# EAGLE schematic chunkycopter-v2 (EAGLE 9.6.2)
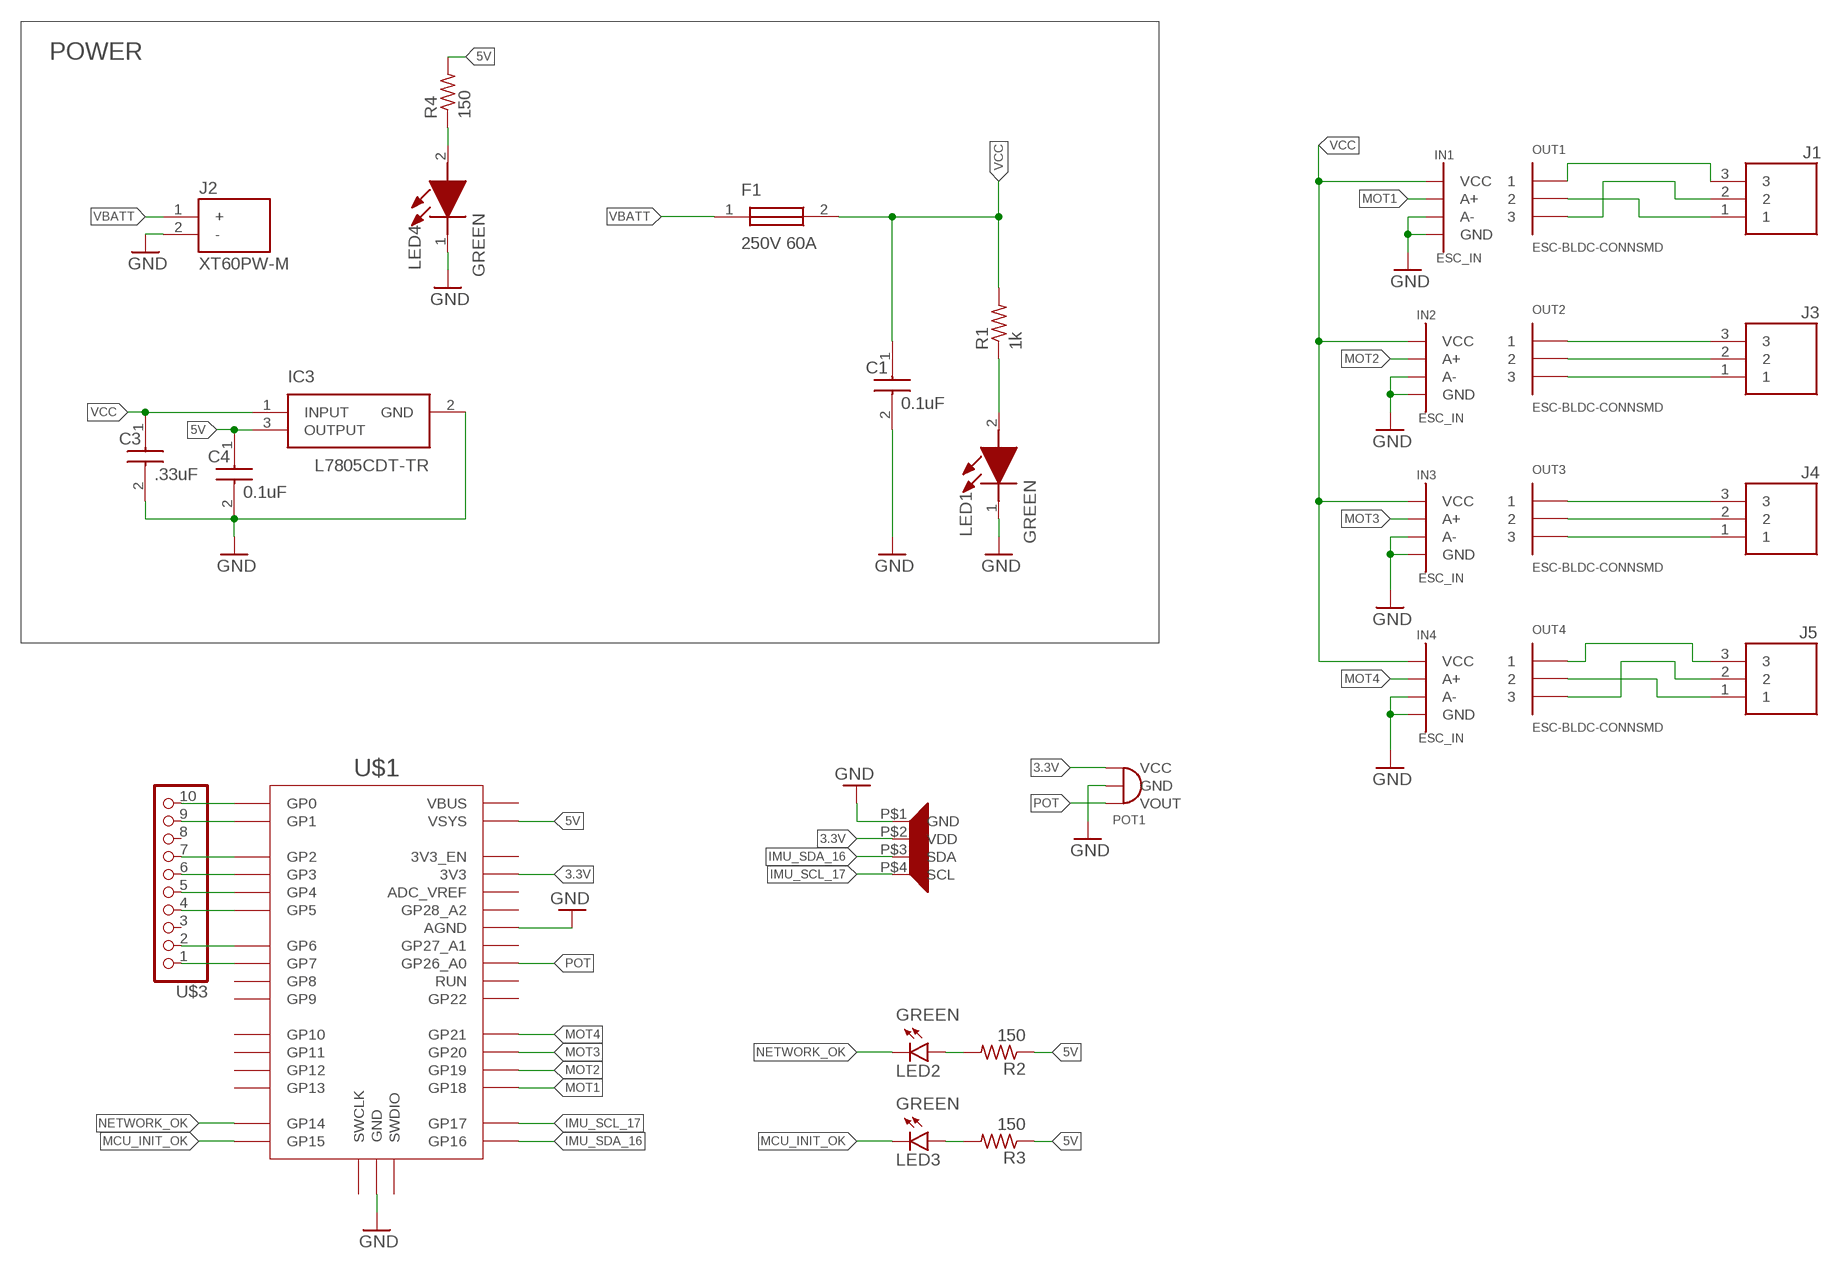
[diagram p0: schematic, sheet 1]

## Parts
C1  0.1uF  C0805C104K5RACTU  [C0805]
C3  .33uF  C0805C334K5RACTU  [C0805]
C4  0.1uF  C0805C104K5RACTU  [C0805]
F1  250V 60A  0456060.DRSDE  [0456060DRSDE]
IC3  L7805CDT-TR  [L7805CDTTR]
IN1  ESC_IN  [ESC-INPUT]
IN2  ESC_IN  [ESC-INPUT]
IN3  ESC_IN  [ESC-INPUT]
IN4  ESC_IN  [ESC-INPUT]
J1  MOLEX-CONN-39-30-3037  [39303037]
J2  XT60PW-M  [AMASS_XT60PW-M]
J3  MOLEX-CONN-39-30-3037  [39303037]
J4  MOLEX-CONN-39-30-3037  [39303037]
J5  MOLEX-CONN-39-30-3037  [39303037]
LED1  GREEN  SML012ENTT86  [SML012ENTT86]
LED2  GREEN  LEDCHIPLED_0603  [CHIPLED_0603]
LED3  GREEN  LEDCHIPLED_0603  [CHIPLED_0603]
LED4  GREEN  SML012ENTT86  [SML012ENTT86]
OUT1  ESC-BLDC-CONNSMD  [ESC-OUT]
OUT2  ESC-BLDC-CONNSMD  [ESC-OUT]
OUT3  ESC-BLDC-CONNSMD  [ESC-OUT]
OUT4  ESC-BLDC-CONNSMD  [ESC-OUT]
POT1  POT-CONN  [POT]
R1  1k  R-US_R0805  [R0805]
R2  150  R-US_R0805  [R0805]
R3  150  R-US_R0805  [R0805]
R4  150  R-US_R0805  [R0805]
U$1  RPI_PICO-TH  [RPI_PICO_TH]
U$2  LSM9DS1_IMU  [LSM9DS1_IMU]
U$3  PINHD-1X10  [1X10-BIG]

## Nets
3.3V: POT1.P_VCC(VCC) U$1.3V3 U$2.P$2(VDD)
5V: C4.1 IC3.3(OUTPUT) R2.1 R3.1 R4.2 U$1.VSYS
GND: C1.2 C3.2 C4.2 IC3.2(GND) IN1.A- IN1.GND IN2.A- IN2.GND IN3.A- IN3.GND IN4.A- IN4.GND J2.2(-) LED1.1(K) LED4.1(K) POT1.P_GND(GND) U$1.AGND U$1.GND@1(GND) U$1.GND@2(GND) U$1.GND@3(GND) U$1.GND@4(GND) U$1.GND@5(GND) U$1.GND@6(GND) U$1.GND@7(GND) U$1.GND@8(GND) U$2.P$1(GND)
IMU_SCL_17: U$1.GP17 U$2.P$4(SCL)
IMU_SDA_16: U$1.GP16 U$2.P$3(SDA)
MCU_INIT_OK: LED3.C U$1.GP15
MOT1: IN1.A+ U$1.GP18
MOT2: IN2.A+ U$1.GP19
MOT3: IN3.A+ U$1.GP20
MOT4: IN4.A+ U$1.GP21
N$1: LED1.2(A) R1.1
N$2: J1.3 OUT1.1
N$3: J1.2 OUT1.3
N$4: J1.1 OUT1.2
N$5: J3.3 OUT2.1
N$6: J3.2 OUT2.2
N$7: J3.1 OUT2.3
N$8: J4.3 OUT3.1
N$9: J5.3 OUT4.1
N$10: J4.1 OUT3.3
N$11: J5.1 OUT4.2
N$12: J5.2 OUT4.3
N$13: U$1.GP0 U$3.10
N$14: U$1.GP1 U$3.9
N$15: J4.2 OUT3.2
N$16: U$1.GP2 U$3.7
N$17: U$1.GP3 U$3.6
N$18: U$1.GP4 U$3.5
N$19: U$1.GP5 U$3.4
N$20: U$1.GP6 U$3.2
N$21: U$1.GP7 U$3.1
N$22: LED2.A R2.2
N$23: LED3.A R3.2
N$24: LED4.2(A) R4.1
NETWORK_OK: LED2.C U$1.GP14
POT: POT1.P_VOUT(VOUT) U$1.GP26_A0
VBATT: F1.1 J2.1(+)
VCC: C1.1 C3.1 F1.2 IC3.1(INPUT) IN1.VCC IN2.VCC IN3.VCC IN4.VCC R1.2
Unconnected: U$1.3V3_EN U$1.ADC_VREF U$1.GP8 U$1.GP9 U$1.GP10 U$1.GP11 U$1.GP12 U$1.GP13 U$1.GP22 U$1.GP27_A1 U$1.GP28_A2 U$1.RUN U$1.SWCLK U$1.SWDIO U$1.VBUS U$3.3 U$3.8

## Notes on the sheet
- POWER

## Library data of the parts
C1 C4 = C0805C104K5RACTU:C0805C104K5RACTU: SMD Comm X7R, Ceramic, 0.1 uF, 10%, 50 VDC, 125 VDC, 125C, -55C, X7R, SMD, MLCC, Temperature Stable, Class II, 2.5 % , 5 GOhms, 11 mg, 0805, 2mm, 1.25mm, 0.78mm, 0.75mm, 0.5mm, 4000, 78 Weeks, 80 Source: Datasheet <https://content.kemet.com/datasheets/KEM_C1002_X7R_SMD.pdf>; DESCRIPTION: SMD Comm X7R, Ceramic, 0.1 uF, 10%, 50 VDC, 125 VDC, 125C, -55C, X7R, SMD, MLCC, Temperature Stable, Class II, 2.5 % , 5 GOhms, 11 mg, 0805, 2mm, 1.25mm, 0.78mm, 0.75mm, 0.5mm, 4000, 78 Weeks, 80; HEIGHT: 1.1mm; MANUFACTURER_NAME: KEMET; MANUFACTURER_PART_NUMBER: C0805C104K5RACTU; MOUSER_PART_NUMBER: 80-C0805C104K5R; MOUSER_PRICE-STOCK: https://www.mouser.co.uk/ProductDetail/KEMET/C0805C104K5RACTU?qs=Pc30aiB8zWUISNb2Qeyxfw%3D%3D
C3 = C0805C334K5RACTU:C0805C334K5RACTU: SMD Comm X7R, Ceramic, 0.33 uF, 10%, 50 VDC, 125 VDC, 125C, -55C, X7R, SMD, MLCC, Temperature Stable, Class II, 2.5 % , 1.5152 GOhms, 13 mg, 0805, 2mm, 1.25mm, 0.9mm, 0.75mm, 0.5mm, 4000, 78 Weeks, 80 Source: Datasheet <https://content.kemet.com/datasheets/KEM_C1002_X7R_SMD.pdf>; DESCRIPTION: SMD Comm X7R, Ceramic, 0.33 uF, 10%, 50 VDC, 125 VDC, 125C, -55C, X7R, SMD, MLCC, Temperature Stable, Class II, 2.5 % , 1.5152 GOhms, 13 mg, 0805, 2mm, 1.25mm, 0.9mm, 0.75mm, 0.5mm, 4000, 78 Weeks, 80; HEIGHT: 1.1mm; MANUFACTURER_NAME: KEMET; MANUFACTURER_PART_NUMBER: C0805C334K5RACTU; MOUSER_PART_NUMBER: 80-C0805C334K5R; MOUSER_PRICE-STOCK: https://www.mouser.co.uk/ProductDetail/KEMET/C0805C334K5RACTU?qs=nRD1PKnFC2Hh3tSy%2FGeH2Q%3D%3D
F1 = 0456060.DRSDE:0456060.DRSDE: Surface Mount Fuses 60 AMP HIGH CURRENT SMD FUSE Source: Datasheet <https://www.littelfuse.com/~/media/electronics/datasheets/fuses/littelfuse_fuse_456sde_datasheet.pdf.pdf>; DESCRIPTION: Surface Mount Fuses 60 AMP HIGH CURRENT SMD FUSE; HEIGHT: 4.5mm; MANUFACTURER_NAME: LITTELFUSE; MANUFACTURER_PART_NUMBER: 0456060.DRSDE; MOUSER_PART_NUMBER: 576-0456060.DRSDE; MOUSER_PRICE-STOCK: https://www.mouser.co.uk/ProductDetail/Littelfuse/0456060.DRSDE?qs=pUKx8fyJudDvlSmwSkC8QA%3D%3D
IC3 = L7805CDT-TR:L7805CDT-TR: Linear Voltage Regulators 5.0V 1.0A Positive Source: Datasheet <https://componentsearchengine.com/Datasheets/2/L7805CDT-TR.pdf>; DESCRIPTION: Linear Voltage Regulators 5.0V 1.0A Positive; HEIGHT: 2.63mm; MANUFACTURER_NAME: STMicroelectronics; MANUFACTURER_PART_NUMBER: L7805CDT-TR; MOUSER_PART_NUMBER: 511-L7805CDT-TR; MOUSER_PRICE-STOCK: https://www.mouser.co.uk/ProductDetail/STMicroelectronics/L7805CDT-TR?qs=gq%2F78KzUDX67VndS%2FbSB4Q%3D%3D
IN1-IN4 = ESC_IN:ESC_IN
J1 J3-J5 = 39-30-3037:MOLEX-CONN-39-30-3037: Headers & Wire Housings 3 CKT R/A HEADER Source: Datasheet <https://www.molex.com/pdm_docs/sd/039303032_sd.pdf>; DESCRIPTION: Headers & Wire Housings 3 CKT R/A HEADER; HEIGHT: 7.2mm; MANUFACTURER_NAME: Molex; MANUFACTURER_PART_NUMBER: 39-30-3037; MOUSER_PART_NUMBER: 538-39-30-3037; MOUSER_PRICE-STOCK: https://www.mouser.co.uk/ProductDetail/Molex/39-30-3037?qs=404muyNbhLHF2IIVL5BKbQ%3D%3D
J2 = XT60PW-M:XT60PW-M: Check availability <https://pricing.snapeda.com/parts/XT60PW-M/AMASS/view-part?ref=eda>; AVAILABILITY: Not in stock; DESCRIPTION: Socket, DC supply, male, PIN: 2; MF: AMASS; MP: XT60PW-M; PACKAGE: Package; PRICE: None
LED1 LED4 = SML012ENTT86:SML012ENTT86: Standard LEDs - SMD CHIP LED WITH REFLECTOR Source: Datasheet <https://fscdn.rohm.com/en/products/databook/datasheet/opto/led/chip_mono/sml012entt86-e.pdf>; DESCRIPTION: Standard LEDs - SMD CHIP LED WITH REFLECTOR; HEIGHT: 1.5mm; MANUFACTURER_NAME: ROHM Semiconductor; MANUFACTURER_PART_NUMBER: SML012ENTT86; MOUSER_PART_NUMBER: 755-SML012ENTT86; MOUSER_PRICE-STOCK: https://www.mouser.co.uk/ProductDetail/ROHM-Semiconductor/SML012ENTT86?qs=tlsG%2FOw5FFictRsqziaydg%3D%3D
LED2 LED3 = led:LED: LED OSRAM: - CHIPLED LG R971, LG N971, LY N971, LG Q971, LY Q971, LO R971, LY R971 LH N974, LH R974 LS Q976, LO Q976, LY Q976 LO Q996 - Hyper CHIPLED LW Q18S LB Q993, LB Q99A, LB R99A - SideLED LS A670, LO A670, LY A670, LG A670, LP A670 LB A673, LV A673, LT A673, LW A673 LH A674 LY A675 LS A676, LA A676, LO A676, LY A676, LW A676 LS A679, LY A679, LG A679 - Hyper Micro SIDELED® LS Y876, LA Y876, LO Y876, LY Y876 LT Y87S - SmartLED LW L88C, LW L88S LB L89C, LB L89S, LG L890 LS L89K, LO L89K, LY L89K LS L896, LA L896, LO L896, LY L896 - TOPLED LS T670, LO T670, LY T670, LG T670, LP T670 LSG T670, LSP T670, LSY T670, LOP T670, LYG T670 LG T671, LOG T671, LSG T671 LB T673, LV T673, LT T673, LW T673 LH T674 LS T676, LA T676, LO T676, LY T676, LB T676, LH T676, LSB T676, LW T676 LB T67C, LV T67C, LT T67C, LS T67K, LO T67K, LY T67K, LW E67C LS E67B, LA E67B, LO E67B, LY E67B, LB E67C, LV E67C, LT E67C LW T67C LS T679, LY T679, LG T679 LS T770, LO T770, LY T770, LG T770, LP T770 LB T773, LV T773, LT T773, LW T773 LH T774 LS E675, LA E675, LY E675, LS T675 LS T776, LA T776, LO T776, LY T776, LB T776 LHGB T686 LT T68C, LB T68C - Hyper Mini TOPLED® LB M676 - Mini TOPLED Santana® LG M470 LS M47K, LO M47K, LY M47K Source: http://www.osram.convergy.de LUXEON: - LUMILED® LXK2-PW12-R00, LXK2-PW12-S00, LXK2-PW14-U00, LXK2-PW14-V00 LXK2-PM12-R00, LXK2-PM12-S00, LXK2-PM14-U00 LXK2-PE12-Q00, LXK2-PE12-R00, LXK2-PE12-S00, LXK2-PE14-T00, LXK2-PE14-U00 LXK2-PB12-K00, LXK2-PB12-L00, LXK2-PB12-M00, LXK2-PB14-N00, LXK2-PB14-P00, LXK2-PB14-Q00 LXK2-PR12-L00, LXK2-PR12-M00, LXK2-PR14-Q00, LXK2-PR14-R00 LXK2-PD12-Q00, LXK2-PD12-R00, LXK2-PD12-S00 LXK2-PH12-R00, LXK2-PH12-S00 LXK2-PL12-P00, LXK2-PL12-Q00, LXK2-PL12-R00 Source: www.luxeon.com KINGBRIGHT: KA-3528ASYC Source: www.kingbright.com
OUT1-OUT4 = esc_bldc_connector:ESC-BLDC-CONN
POT1 = POT_CONN:POT-CONN
R1-R4 = adafruit:R-US_: RESISTOR, American symbol
U$1 = RaspberryPi_Pico:RPI_PICO
U$2 = LSM9DS1_IMU:LSM9DS1_IMU
U$3 = adafruit:PINHD-1X10: Pin header 1x10 0.1" spacing With round pins